# Altium schematic sheet 放大电路.SchDoc
size A3
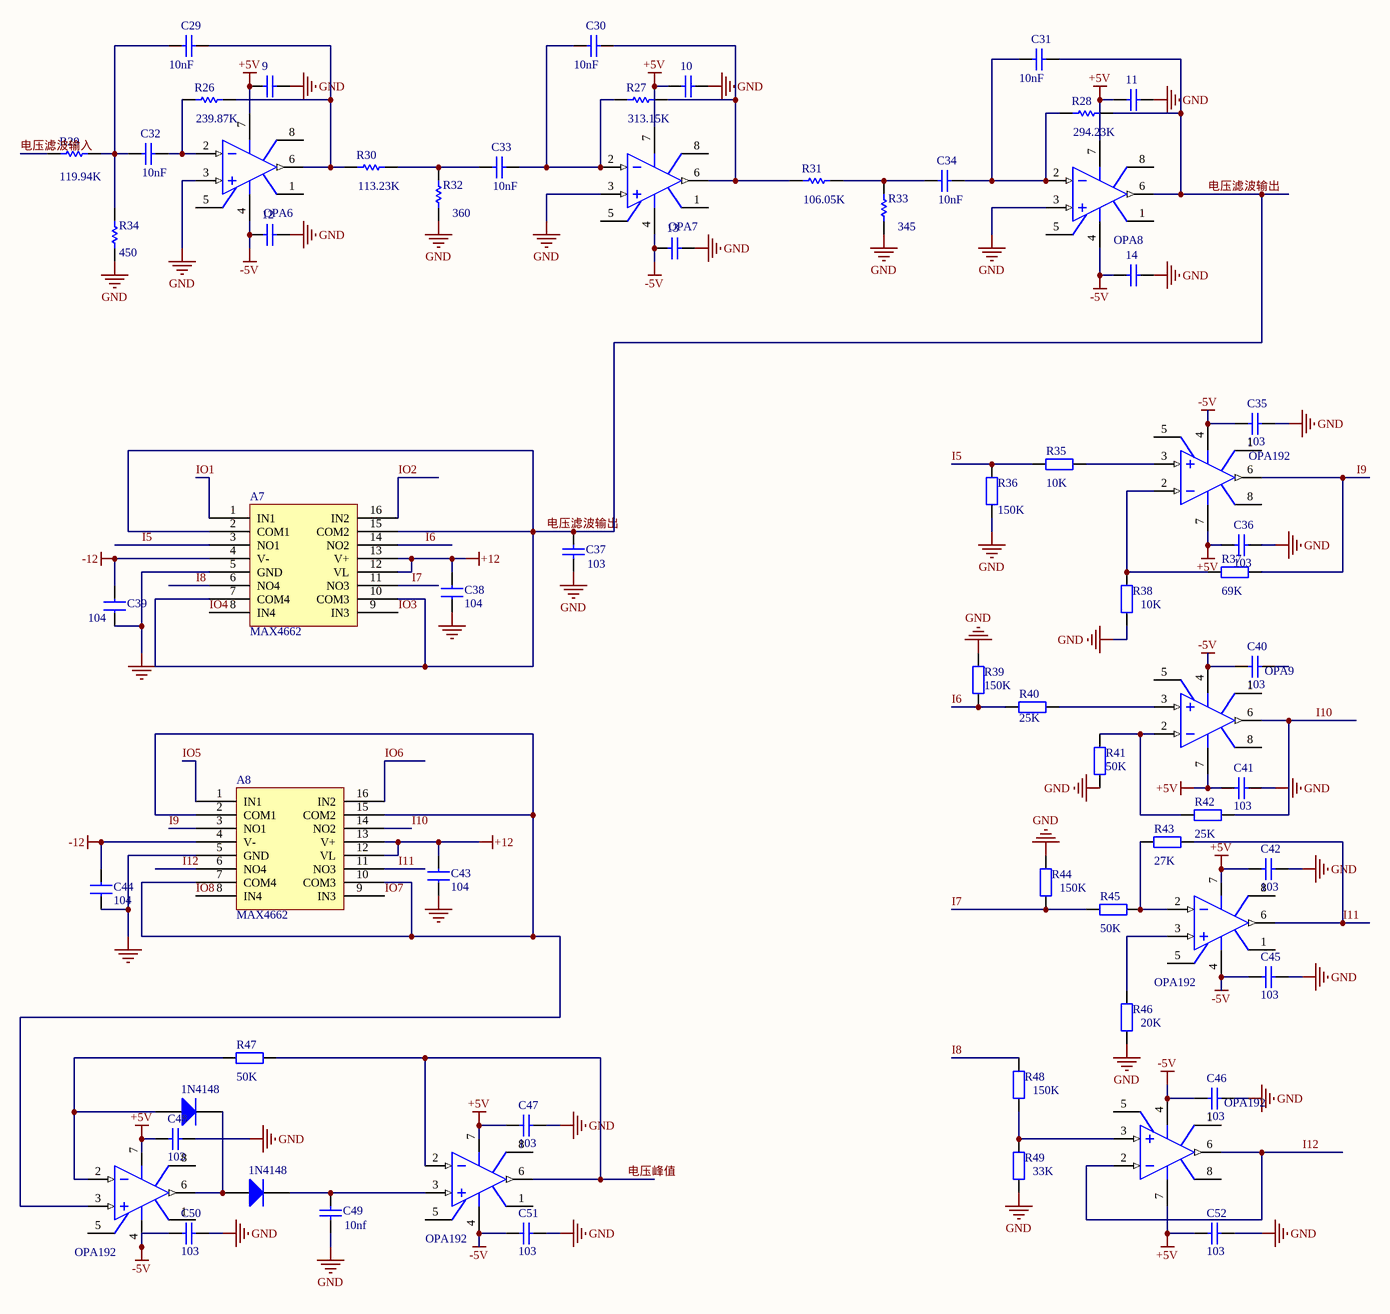
[diagram p0: 放大电路.SchDoc]

## Parts
(Parts that share a designator on the sheet are numbered #1, #2 ... from top to bottom, then left to right.)
1N4148#1  Diode 1N4001  [DO-41]  (value not drawn)
1N4148#2  Diode 1N4001  [DO-41]  (value not drawn)
9  Cap  [RAD-0.3]  (value not drawn)
10  Cap  [RAD-0.3]  (value not drawn)
11  Cap  [RAD-0.3]  (value not drawn)
12  Cap  [RAD-0.3]  (value not drawn)
13  Cap  [RAD-0.3]  (value not drawn)
14  Cap  [RAD-0.3]  (value not drawn)
A7  MAX4662
A8  MAX4662
C29  value 10nF  [RAD-0.3]  (hidden comment: Cap)
C30  value 10nF  [RAD-0.3]  (hidden comment: Cap)
C31  value 10nF  [RAD-0.3]  (hidden comment: Cap)
C32  value 10nF  [RAD-0.3]  (hidden comment: Cap)
C33  value 10nF  [RAD-0.3]  (hidden comment: Cap)
C34  value 10nF  [RAD-0.3]  (hidden comment: Cap)
C35  value 103  [RAD-0.3]  (hidden comment: Cap)
C36  value 103  [RAD-0.3]  (hidden comment: Cap)
C37  value 103  [RAD-0.3]  (hidden comment: Cap)
C38  104  [RAD0.1]
C39  104  [RAD0.1]
C40  value 103  [RAD-0.3]  (hidden comment: Cap)
C41  value 103  [RAD-0.3]  (hidden comment: Cap)
C42  value 103  [RAD-0.3]  (hidden comment: Cap)
C43  104  [RAD0.1]
C44  104  [RAD0.1]
C45  value 103  [RAD-0.3]  (hidden comment: Cap)
C46  value 103  [RAD-0.3]  (hidden comment: Cap)
C47  value 103  [RAD-0.3]  (hidden comment: Cap)
C48  value 103  [RAD-0.3]  (hidden comment: Cap)
C49  value 10nf  [RAD-0.3]  (hidden comment: Cap)
C50  value 103  [RAD-0.3]  (hidden comment: Cap)
C51  value 103  [RAD-0.3]  (hidden comment: Cap)
C52  value 103  [RAD-0.3]  (hidden comment: Cap)
OPA6  Op Amp  [H-08A]  (value not drawn)
OPA7  Op Amp  [H-08A]  (value not drawn)
OPA8  Op Amp  [H-08A]  (value not drawn)
OPA9  Op Amp  [H-08A]  (value not drawn)
OPA192#1  Op Amp  [H-08A]  (value not drawn)
OPA192#2  Op Amp  [H-08A]  (value not drawn)
OPA192#3  Op Amp  [H-08A]  (value not drawn)
OPA192#4  Op Amp  [H-08A]  (value not drawn)
OPA192#5  Op Amp  [H-08A]  (value not drawn)
R26  value 239.87K  [AXIAL-0.3]  (hidden comment: Res1)
R27  value 313.15K  [AXIAL-0.3]  (hidden comment: Res1)
R28  value 294.23K  [AXIAL-0.3]  (hidden comment: Res1)
R29  value 119.94K  [AXIAL-0.3]  (hidden comment: Res1)
R30  value 113.23K  [AXIAL-0.3]  (hidden comment: Res1)
R31  value 106.05K  [AXIAL-0.3]  (hidden comment: Res1)
R32  value 360  [AXIAL-0.3]  (hidden comment: Res1)
R33  value 345  [AXIAL-0.3]  (hidden comment: Res1)
R34  value 450  [AXIAL-0.3]  (hidden comment: Res1)
R35  value 10K  [AXIAL-0.4]  (hidden comment: Res2)
R36  value 150K  [AXIAL-0.4]  (hidden comment: Res2)
R37  value 69K  [AXIAL-0.4]  (hidden comment: Res2)
R38  value 10K  [AXIAL-0.4]  (hidden comment: Res2)
R39  value 150K  [AXIAL-0.4]  (hidden comment: Res2)
R40  value 25K  [AXIAL-0.4]  (hidden comment: Res2)
R41  value 50K  [AXIAL-0.4]  (hidden comment: Res2)
R42  value 25K  [AXIAL-0.4]  (hidden comment: Res2)
R43  value 27K  [AXIAL-0.4]  (hidden comment: Res2)
R44  value 150K  [AXIAL-0.4]  (hidden comment: Res2)
R45  value 50K  [AXIAL-0.4]  (hidden comment: Res2)
R46  value 20K  [AXIAL-0.4]  (hidden comment: Res2)
R47  value 50K  [AXIAL-0.4]  (hidden comment: Res2)
R48  value 150K  [AXIAL-0.4]  (hidden comment: Res2)
R49  value 33K  [AXIAL-0.4]  (hidden comment: Res2)

## Nets
+5V: 9.1 10.1 11.1 C36.2 C41.2 C42.2 C47.2 C48.2 C52.2 OPA6.7(V+) OPA7.7(V+) OPA8.7(V+) OPA9.7(V+) OPA192#1.7(V+) OPA192#2.7(V+) OPA192#3.7(V+) OPA192#4.7(V+) OPA192#5.7(V+)
+12: A7.12(VL) A7.13(V+) A8.12(VL) A8.13(V+) C38.1 C43.1
-5V: 12.1 13.1 14.1 C35.2 C40.2 C45.2 C46.2 C50.2 C51.2 OPA6.4(V-) OPA7.4(V-) OPA8.4(V-) OPA9.4(V-) OPA192#1.4(V-) OPA192#2.4(V-) OPA192#3.4(V-) OPA192#4.4(V-) OPA192#5.4(V-)
-12: A7.4(V-) A8.4(V-) C39.2 C44.2
GND: 9.2 10.2 11.2 12.2 13.2 14.2 A7.5(GND) A8.5(GND) C35.1 C36.1 C37.1 C38.2 C39.1 C41.1 C42.1 C43.2 C44.1 C45.1 C46.1 C47.1 C48.1 C49.2 C50.1 C51.1 C52.1 OPA6.3(IN+) OPA7.3(IN+) OPA8.3(IN+) R32.1 R33.1 R34.1 R36.2 R38.1 R39.2 R41.1 R44.2 R46.2 R49.2
I5: A7.3(NO1) R35.1 R36.1
I6: A7.14(NO2) R39.1 R40.1
I7: A7.11(NO3) R44.1 R45.2
I8: A7.6(NO4) R48.1
I9: A8.3(NO1) OPA192#1.6(OUT) R37.1
I10: A8.14(NO2) OPA9.6(OUT) R42.1
I11: A8.11(NO3) OPA192#2.6(OUT) R43.1
I12: A8.6(NO4) OPA192#5.2(IN-) OPA192#5.6(OUT)
IO1: A7.1(IN1)
IO2: A7.16(IN2)
IO3: A7.9(IN3)
IO4: A7.8(IN4)
IO5: A8.1(IN1)
IO6: A8.16(IN2)
IO7: A8.9(IN3)
IO8: A8.8(IN4)
电压峰值: OPA192#3.2(IN-) OPA192#3.6(OUT) R47.2
电压滤波输入: R29.1
电压滤波输出: A7.2(COM1) A7.7(COM4) A7.10(COM3) A7.15(COM2) C31.2 C37.2 OPA8.6(OUT) R28.2
Net1N4148#1_1: 1N4148#1.1(A) OPA192#4.2(IN-) R47.1
Net1N4148#1_2: 1N4148#1.2(K) 1N4148#2.1(A) OPA192#4.6(OUT)
Net1N4148#2_2: 1N4148#2.2(K) C49.1 OPA192#3.3(IN+)
NetA8_2: A8.2(COM1) A8.7(COM4) A8.10(COM3) A8.15(COM2) OPA192#4.3(IN+)
NetC29_1: C29.1 C32.1 R29.2 R34.2
NetC29_2: C29.2 OPA6.6(OUT) R26.2 R30.1
NetC30_1: C30.1 C33.2 OPA7.2(IN-) R27.1
NetC30_2: C30.2 OPA7.6(OUT) R27.2 R31.1
NetC31_1: C31.1 C34.2 OPA8.2(IN-) R28.1
NetC32_2: C32.2 OPA6.2(IN-) R26.1
NetC33_1: C33.1 R30.2 R32.2
NetC34_1: C34.1 R31.2 R33.2
NetOPA9_2: OPA9.2(IN-) R41.2 R42.2
NetOPA9_3: OPA9.3(IN+) R40.2
NetOPA192#1_2: OPA192#1.2(IN-) R37.2 R38.2
NetOPA192#1_3: OPA192#1.3(IN+) R35.2
NetOPA192#2_2: OPA192#2.2(IN-) R43.2 R45.1
NetOPA192#2_3: OPA192#2.3(IN+) R46.1
NetOPA192#5_3: OPA192#5.3(IN+) R48.2 R49.1

Not connected (* = marked no-connect by the designer): C40 1; OPA6 1(OS_NUL) 5(OS_NUL) 8(TAB); OPA7 1(OS_NUL) 5(OS_NUL) 8(TAB); OPA8 1(OS_NUL) 5(OS_NUL) 8(TAB); OPA9 1(OS_NUL) 5(OS_NUL) 8(TAB); OPA192#1 1(OS_NUL) 5(OS_NUL) 8(TAB); OPA192#2 1(OS_NUL) 5(OS_NUL) 8(TAB); OPA192#3 1(OS_NUL) 5(OS_NUL) 8(TAB); OPA192#4 1(OS_NUL) 5(OS_NUL) 8(TAB); OPA192#5 1(OS_NUL) 5(OS_NUL) 8(TAB)

## Library data of the parts
1N4148#1 1N4148#2 = Diode 1N4001: 1 Amp General Purpose Rectifier; Published: 8-Jun-2000; LatestRevisionDate: 17-Jul-2002; LatestRevisionNote: Re-released for DXP Platform.; DatasheetVersion: 1998; PackageVersion: Aug-1999; PackageReference: DO-41; Publisher: Altium Limited; PackageDescription: Diode, Axial; Body 5.2 x 2.7 mm (LxDia. max), Lead Dia. 0.86 mm (max); Code_JEDEC: DO-204-AL; ComponentLink1Description: Manufacturer Link; ComponentLink1URL: http://www.fairchildsemi.com/; ComponentLink2Description: Datasheet; ComponentLink2URL: http://www.fairchildsemi.com/ds/1N%2F1N4001.pdf
9-14 = Cap: Capacitor; Value: 100pF; Published: 8-Jun-2000; LatestRevisionDate: 17-Jul-2002; LatestRevisionNote: Re-released for DXP Platform.; PackageReference: RAD-0.3; Publisher: Altium Limited; PackageDescription: Radial Cap, Thru-Hole; 2 Leads; 0.3 in Pin Spacing
A7 A8 = MAX2662
C29-C37 C40-C42 C45-C52 = Cap: Capacitor; Published: 8-Jun-2000; LatestRevisionDate: 17-Jul-2002; LatestRevisionNote: Re-released for DXP Platform.; PackageReference: RAD-0.3; Publisher: Altium Limited; PackageDescription: Radial Cap, Thru-Hole; 2 Leads; 0.3 in Pin Spacing
C38 C39 C43 C44 = CAP: Capacitor; Value: 104
OPA6-OPA9 OPA192#1-OPA192#5 = Op Amp: FET Operational Amplifier; Published: 8-Jun-2000; LatestRevisionDate: 17-Jul-2002; LatestRevisionNote: Re-released for DXP Platform.; DatasheetVersion: REV. B; PackageVersion: 1990; PackageReference: H-08A; Publisher: Altium Limited; PackageDescription: Can; 8 Leads; Pin Circle Dia. 5.08 mm; Lead Dia. 0.53 mm (max); ComponentLink1Description: Manufacturer Link; ComponentLink1URL: http://www.analog.com/
R26-R34 = Res1: Resistor; Published: 8-Jun-2000; LatestRevisionDate: 17-Jul-2002; LatestRevisionNote: Re-released for DXP Platform.; PackageReference: AXIAL-0.3; Publisher: Altium Limited; PackageDescription: Axial Device, Thru-Hole; 2 Leads; 0.3 in Pin Spacing
R35-R49 = Res2: Resistor; Published: 8-Jun-2000; LatestRevisionDate: 17-Jul-2002; LatestRevisionNote: Re-released for DXP Platform.; PackageReference: AXIAL-0.4; Publisher: Altium Limited; PackageDescription: Axial Device, Thru-Hole; 2 Leads; 0.4 in Pin Spacing